# EAGLE design SatNOGSBoard (EAGLE 7.2.0)
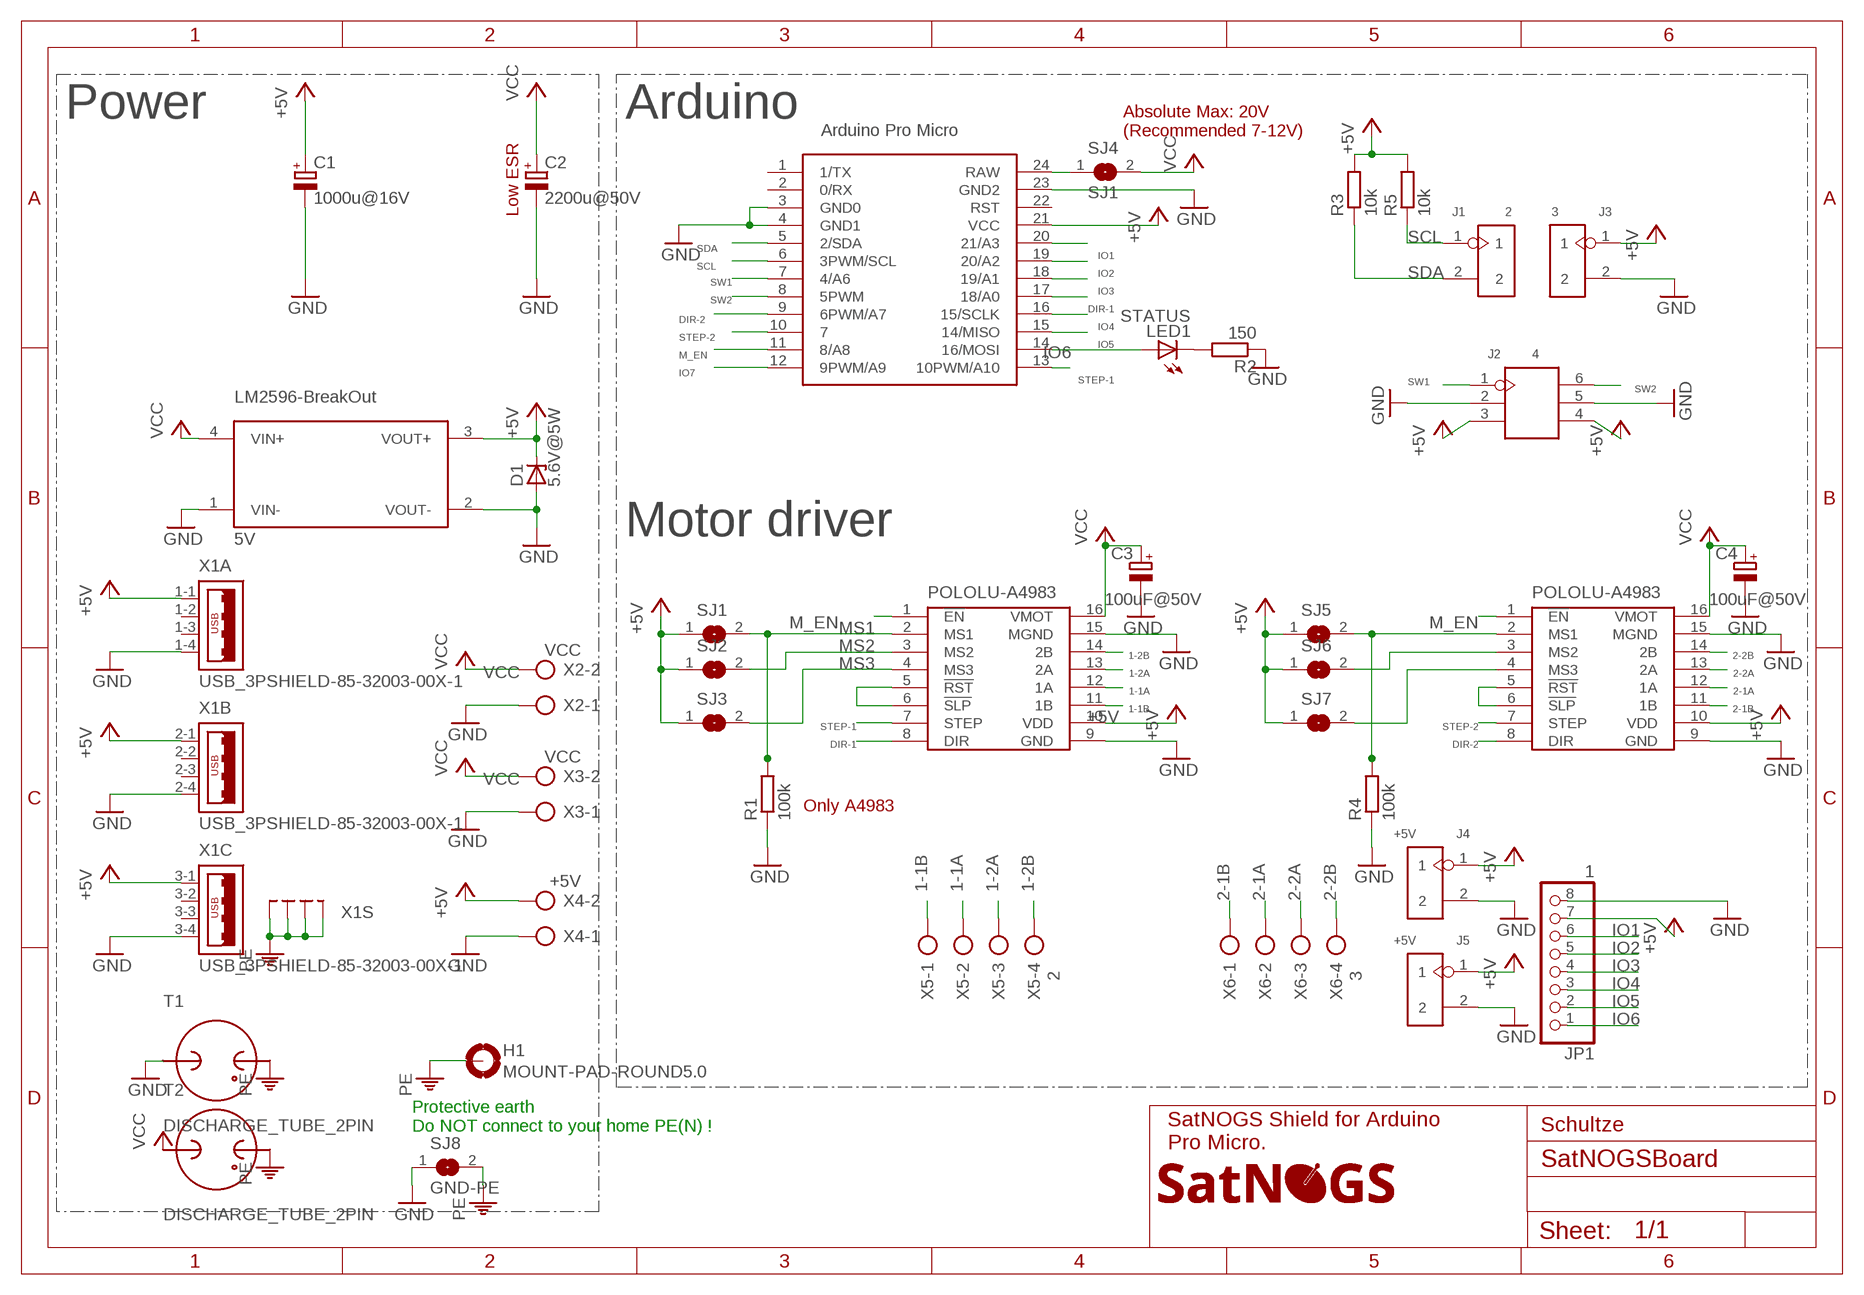
[diagram p0: schematic, sheet 1]

## Parts
B1  5V  LM2596-BREAKOUTLM2596-BREAKOUT  [LM2596-BREAKOUT]
B2  ARDUINO_PRO_MICRO"  [ARDUINO_MICRO_PRO]
B3  POLOLU-A4983/A4988"  [POLOLU-A4983]
B4  POLOLU-A4983/A4988"  [POLOLU-A4983]
C1  1000u@16V  CPOL-EUE3.5-8  [E3,5-8]
C2  2200u@50V  CPOL-EUE7.5-16  [E7,5-16]
C3  100uF@50V  CPOL-EUE2.5-6  [E2,5-6]
C4  100uF@50V  CPOL-EUE2.5-6  [E2,5-6]
D1  5.6V@5W  ZENER-DIODEDO41Z10  [DO41Z10]
H1  MOUNT-PAD-ROUND5.0  [5,0-PAD]
J1  2  HEADER-2P-65/35MIL  [2P-2.54-65/35MIL]
J2  4  HEADER-2X3P-2.54  [2X3P-2.54-65/35MIL]
J3  3  HEADER-2P-65/35MIL  [2P-2.54-65/35MIL]
J4  +5V  HEADER-2P-65/35MIL  [2P-2.54-65/35MIL]
J5  +5V  HEADER-2P-65/35MIL  [2P-2.54-65/35MIL]
JP1  1  PINHD-1X8  [1X08]
LED1  STATUS  LED3MM  [LED3MM]
LOGO1  SATNOGS_LOGOSILK_M  [LOGO_SILK_M]
R1  100k  R-EU_R0805  [R0805]
R2  150  R-EU_R0805  [R0805]
R3  10k  R-EU_R0805  [R0805]
R4  100k  R-EU_R0805  [R0805]
R5  10k  R-EU_R0805  [R0805]
SJ1  SJ1  SJ  [SJ]
SJ2  SJ1  SJ  [SJ]
SJ3  SJ1  SJ  [SJ]
SJ4  SJ1  SJ  [SJ]
SJ5  SJ1  SJ  [SJ]
SJ6  SJ1  SJ  [SJ]
SJ7  SJ1  SJ  [SJ]
SJ8  GND-PE  SJ  [SJ]
T1  DISCHARGE_TUBE_2PIN  [DISCHARGE_2WIRE]
T2  DISCHARGE_TUBE_2PIN  [DISCHARGE_2WIRE]
X1  USB_3PSHIELD-85-32003-00X-1  [85-32003-00X-1]
X2  VCC  AK500/2  [AK500/2]
X3  VCC  AK500/2  [AK500/2]
X4  +5V  AK500/2  [AK500/2]
X5  2  AK500/4  [AK500/4]
X6  3  AK500/4  [AK500/4]

## Nets
1-1A [power]: B3.12(1A) X5.2
1-1B [power]: B3.11(1B) X5.1
1-2A [power]: B3.13(2A) X5.3
1-2B [power]: B3.14(2B) X5.4
2-1A [power]: B4.12(1A) X6.2
2-1B [power]: B4.11(1B) X6.1
2-2A [power]: B4.13(2A) X6.3
2-2B [power]: B4.14(2B) X6.4
+5V: B1.3(VOUT+) B2.21(VCC) B3.10(VDD) B4.10(VDD) C1.+ D1.C J2.3 J2.4 J3.1 J4.1 J5.1 JP1.7 R3.2 R5.2 SJ1.1 SJ2.1 SJ3.1 SJ5.1 SJ6.1 SJ7.1 X1.1-1 X1.2-1 X1.3-1 X4.2
DIR-1: B2.17(18/A0) B3.8(DIR)
DIR-2: B2.9(6PWM/A7) B4.8(DIR)
GND: B1.1(VIN-) B1.2(VOUT-) B2.3(GND0) B2.4(GND1) B2.23(GND2) B3.9(GND) B3.15(MGND) B4.9(GND) B4.15(MGND) C1.- C2.- C3.- C4.- D1.A J2.2 J2.5 J3.2 J4.2 J5.2 JP1.8 R1.1 R2.1 R4.1 SJ8.1 T1.P$1 X1.1-4 X1.2-4 X1.3-4 X2.1 X3.1 X4.1
IO1: B2.20(21/A3) JP1.6
IO2: B2.19(20/A2) JP1.5
IO3: B2.18(19/A1) JP1.4
IO4: B2.16(15/SCLK) JP1.3
IO5: B2.15(14/MISO) JP1.2
IO6: B2.14(16/MOSI) JP1.1 LED1.A
IO7: B2.12(9PWM/A9)
M_EN: B2.11(8/A8) B3.1(!EN) B4.1(!EN)
MS1: B3.2(MS1) R1.2 SJ1.2
MS2: B3.3(MS2) SJ2.2
MS3: B3.4(MS3) SJ3.2
MS4: B4.2(MS1) R4.2 SJ5.2
MS5: B4.3(MS2) SJ6.2
MS6: B4.4(MS3) SJ7.2
N$1: B3.5(!RST) B3.6(!SLP)
N$2: B4.5(!RST) B4.6(!SLP)
N$3: B2.24(RAW) SJ4.1
N$6: LED1.K(C) R2.2
PE: H1.B5(MOUNT) SJ8.2 T1.P$2 T2.P$2 X1.M1(S:S1) X1.M2(S:S2) X1.M3(S:S3) X1.M4(S:S4)
SCL: B2.6(3PWM/SCL) J1.1 R5.1
SDA: B2.5(2/SDA) J1.2 R3.1
STEP-1: B2.13(10PWM/A10) B3.7(STEP)
STEP-2: B2.10 B4.7(STEP)
SW1: B2.7(4/A6) J2.1
SW2: B2.8(5PWM) J2.6
VCC [power]: B1.4(VIN+) B3.16(VMOT) B4.16(VMOT) C2.+ C3.+ C4.+ SJ4.2 T2.P$1 X2.2 X3.2
Unconnected: B2.1(1/TX) B2.2(0/RX) B2.22(RST) X1.1-2 X1.1-3 X1.2-2 X1.2-3 X1.3-2 X1.3-3

## Notes on the sheet
- Power | Arduino
- Absolute Max: 20V
  (Recommended 7-12V)
- Low ESR
- Motor driver
- Only A4983
- Protective earth
  Do NOT connect to your home PE(N) !
- Schultze
- SatNOGS Shield for Arduino
  Pro Micro.

## Library data of the parts
B1 = satnogs:LM2596-BREAKOUT: Break out for LM2596 Switching power supply (regulated) Footprint approx. 41mmx21mm
B2 = satnogs:ARDUINO_PRO_MICRO
B3 B4 = satnogs:POLOLU-A4983/A4988: Stepper motor driver https://www.pololu.com/product/1182
C1-C4 = rcl:CPOL-EU: POLARIZED CAPACITOR, European symbol
D1 = diode:ZENER-DIODE: Z-Diode; MPN: 1N5339B
H1 = holes:MOUNT-PAD-ROUND: MOUNTING PAD, round
J1 J3-J5 = Connector:HEADER-2P
J2 = Connector:HEADER-2X3P
JP1 = pinhead:PINHD-1X8: PIN HEADER
LED1 = led:LED: LED OSRAM: - CHIPLED LG R971, LG N971, LY N971, LG Q971, LY Q971, LO R971, LY R971 LH N974, LH R974 LS Q976, LO Q976, LY Q976 LO Q996 - Hyper CHIPLED LW Q18S LB Q993, LB Q99A, LB R99A - SideLED LS A670, LO A670, LY A670, LG A670, LP A670 LB A673, LV A673, LT A673, LW A673 LH A674 LY A675 LS A676, LA A676, LO A676, LY A676, LW A676 LS A679, LY A679, LG A679 - Hyper Micro SIDELED® LS Y876, LA Y876, LO Y876, LY Y876 LT Y87S - SmartLED LW L88C, LW L88S LB L89C, LB L89S, LG L890 LS L89K, LO L89K, LY L89K LS L896, LA L896, LO L896, LY L896 - TOPLED LS T670, LO T670, LY T670, LG T670, LP T670 LSG T670, LSP T670, LSY T670, LOP T670, LYG T670 LG T671, LOG T671, LSG T671 LB T673, LV T673, LT T673, LW T673 LH T674 LS T676, LA T676, LO T676, LY T676, LB T676, LH T676, LSB T676, LW T676 LB T67C, LV T67C, LT T67C, LS T67K, LO T67K, LY T67K, LW E67C LS E67B, LA E67B, LO E67B, LY E67B, LB E67C, LV E67C, LT E67C LW T67C LS T679, LY T679, LG T679 LS T770, LO T770, LY T770, LG T770, LP T770 LB T773, LV T773, LT T773, LW T773 LH T774 LS E675, LA E675, LY E675, LS T675 LS T776, LA T776, LO T776, LY T776, LB T776 LHGB T686 LT T68C, LB T68C - Hyper Mini TOPLED® LB M676 - Mini TOPLED Santana® LG M470 LS M47K, LO M47K, LY M47K Source: http://www.osram.convergy.de LUXEON: - LUMILED® LXK2-PW12-R00, LXK2-PW12-S00, LXK2-PW14-U00, LXK2-PW14-V00 LXK2-PM12-R00, LXK2-PM12-S00, LXK2-PM14-U00 LXK2-PE12-Q00, LXK2-PE12-R00, LXK2-PE12-S00, LXK2-PE14-T00, LXK2-PE14-U00 LXK2-PB12-K00, LXK2-PB12-L00, LXK2-PB12-M00, LXK2-PB14-N00, LXK2-PB14-P00, LXK2-PB14-Q00 LXK2-PR12-L00, LXK2-PR12-M00, LXK2-PR14-Q00, LXK2-PR14-R00 LXK2-PD12-Q00, LXK2-PD12-R00, LXK2-PD12-S00 LXK2-PH12-R00, LXK2-PH12-S00 LXK2-PL12-P00, LXK2-PL12-Q00, LXK2-PL12-R00 Source: www.luxeon.com KINGBRIGHT: KA-3528ASYC Source: www.kingbright.com
LOGO1 = satnogs:SATNOGS_LOGO
R1-R5 = rcl:R-EU_: RESISTOR, European symbol
SJ1-SJ8 = jumper:SJ: SMD solder JUMPER
T1 T2 = satnogs:DISCHARGE_TUBE_2PIN: 2027 Series - 2-Pole Gas Discharge Tube Surge current 25kA Author: Alexander Schultze (03/15); MF: BOURNS; MPN: 2027-09-CLF; OC_FARNELL: 2383324
X1 = con-cypressindustries:USB_3PSHIELD-: Triple USB Connector Source: www.cypressindustries.com; OC_FARNELL: unknown; OC_NEWARK: unknown
X2-X4 = con-ptr500:AK500/2: CONNECTOR; OC_FARNELL: unknown; OC_NEWARK: unknown
X5 X6 = con-ptr500:AK500/4: CONNECTOR; OC_FARNELL: unknown; OC_NEWARK: unknown

## Net classes
0 default: width 0.203 mm, drill 0.813 mm, clearance 0.254 mm
1 power: width 0.813 mm, drill 0.813 mm, clearance 0.254 mm

## Board
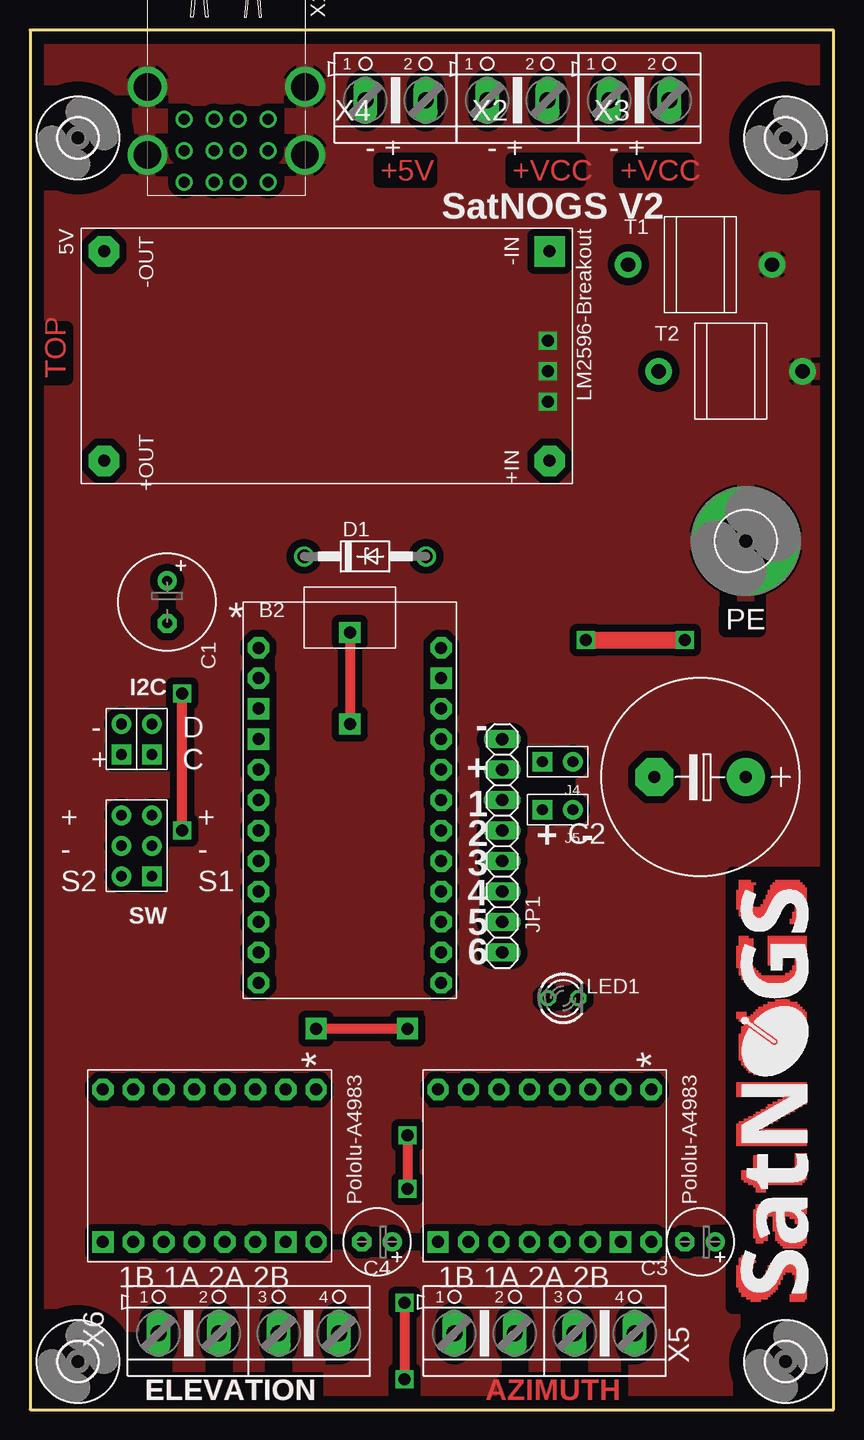
[diagram p1: board, top side]
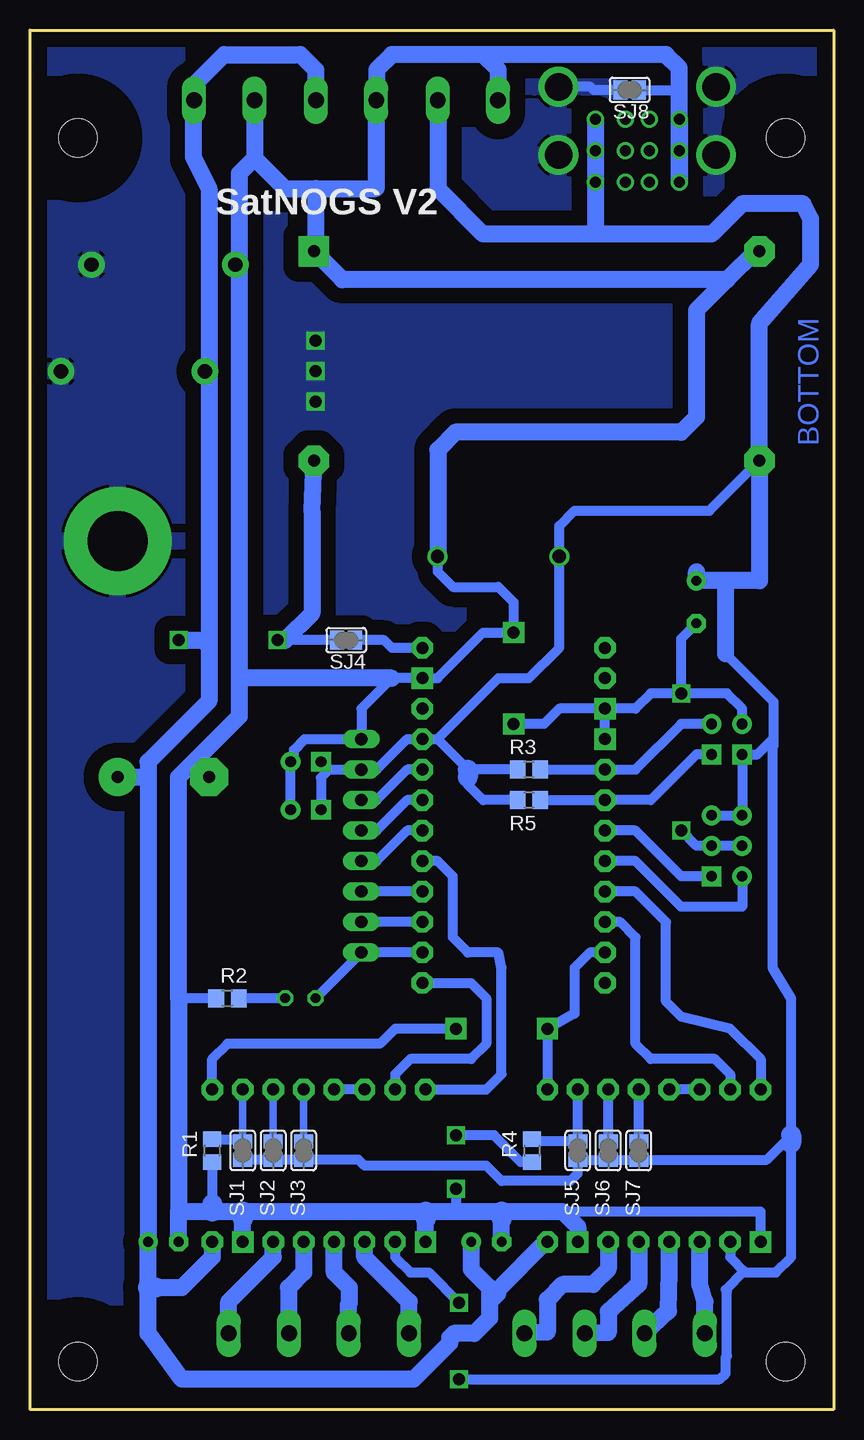
[diagram p2: board, bottom side, seen from below]

Size 67 x 115 mm. Coordinates in mm from the lower left corner, seen from the top.
Outline: 0,0 67,0 67,115 0,115 0,0
Copper layers (1*16): Top 0.035mm / dielectric 1.5mm / Bottom 0.035mm
Design rules "platinenbelichter *": minimum track width 8mil, minimum drill 24mil, track to track 10mil, track to pad 10mil, pad to pad 10mil, via to via 10mil, smd to smd 10mil, copper to edge 40mil, drill to drill 8mil, minimum pad ring 10mil, minimum via ring 8mil, stop-mask expansion 10mil, vias tented up to drill 0mil, thermal gap 10mil

### Footprints (pad centres in the part's own frame; a part is rotated, then mirrored left to right if it is on the bottom)
LM2596-BREAKOUT = drill 1 pad 2.54 square: 1 -8.89,17.78 | drill 1 pad 2.54 octagon: 2 -8.89,-19.367; 3 8.572,-19.367; 4 8.572,17.78
ARDUINO_MICRO_PRO = drill 1 pad 1.778 octagon: 1 -7.62,12.7; 2 -7.62,10.16; 5 -7.62,2.54; 6 -7.62,0; 7 -7.62,-2.54; 8 -7.62,-5.08; 9 -7.62,-7.62; 10 -7.62,-10.16; 11 -7.62,-12.7; 12 -7.62,-15.24; 13 7.62,-15.24; 14 7.62,-12.7; 15 7.62,-10.16; 16 7.62,-7.62; 17 7.62,-5.08; 18 7.62,-2.54; 19 7.62,0; 20 7.62,2.54; 21 7.62,5.08; 22 7.62,7.62; 24 7.62,12.7 | drill 1 pad 1.778 square: 3 -7.62,7.62; 4 -7.62,5.08; 23 7.62,10.16
POLOLU-A4983 = drill 1 pad 1.778 octagon: 1 -6.35,8.89; 2 -6.35,6.35; 3 -6.35,3.81; 4 -6.35,1.27; 5 -6.35,-1.27; 6 -6.35,-3.81; 7 -6.35,-6.35; 8 -6.35,-8.89; 10 6.35,-6.35; 11 6.35,-3.81; 12 6.35,-1.27; 13 6.35,1.27; 14 6.35,3.81; 16 6.35,8.89 | drill 1 pad 1.778 square: 9 6.35,-8.89; 15 6.35,6.35
E3,5-8 = drill 0.813 pad 1.6: + -1.778,0 | drill 0.813 pad 1.6 octagon: - 1.778,0
E7,5-16 = drill 1.016 pad 3.15: + -3.81,0 | drill 1.016 pad 3.15 octagon: - 3.81,0
E2,5-6 = drill 0.813 pad 1.6: + -1.27,0 | drill 0.813 pad 1.6 octagon: - 1.27,0
DO41Z10 = drill 1.118: A 5.08,0; C -5.08,0
5,0-PAD = drill 5 pad 9: B5 0,0
2P-2.54-65/35MIL = drill 0.889 pad 1.651 square: 1 0,1.27 | drill 0.889 pad 1.651: 2 0,-1.27
2X3P-2.54-65/35MIL = drill 0.889 pad 1.651 square: 1 -1.27,2.54 | drill 0.889 pad 1.651: 2 -1.27,0; 3 -1.27,-2.54; 4 1.27,-2.54; 5 1.27,0; 6 1.27,2.54
1X08 = drill 1.016 long: 1 -8.89,0; 2 -6.35,0; 3 -3.81,0; 4 -1.27,0; 5 1.27,0; 6 3.81,0; 7 6.35,0; 8 8.89,0
LED3MM = drill 0.813 octagon: A -1.27,0; K 1.27,0
R0805 = smd 1.3 x 1.5: 1 -0.95,0; 2 0.95,0
SJ = smd 1.168 x 1.6: 1 -0.762,0; 2 0.762,0
DISCHARGE_2WIRE = drill 1.2 pad 2.2: P$1 -6,0; P$2 6,0
3,2 = hole 3.2: 0,0
85-32003-00X-1 = drill 0.92 pad 1.27: 1-1 2.71,3.5; 1-2 2.71,1; 1-3 2.71,-1; 1-4 2.71,-3.5; 2-1 5.33,3.5; 2-2 5.33,1; 2-3 5.33,-1; 2-4 5.33,-3.5; 3-1 7.95,3.5; 3-2 7.95,1; 3-3 7.95,-1; 3-4 7.95,-3.5 | drill 2.3 pad 3: M1 0,6.57; M2 0,-6.57; M3 5.68,6.57; M4 5.68,-6.57
AK500/2 = drill 1.321 long: 1 -2.515,0; 2 2.515,0
AK500/4 = drill 1.321 long: 1 -7.518,0; 2 -2.489,0; 3 2.489,0; 4 7.518,0

### Placement (x,y rotation side)
B1  25.55,87.67 270 top
B2  26.67,50.8 0 top
B3  42.91,20.32 270 top
B4  14.97,20.32 270 top
C1  11.43,67.31 270 top
C2  55.88,52.72 180 top
C3  55.88,13.97 180 top
C4  28.94,13.97 180 top
D1  27.94,71.12 0 top
H1  59.69,72.39 0 top
J1  10.16,55.88 180 top
J2  8.89,46.99 180 top
J3  7.62,55.88 180 top
J4  44,54 90 top
J5  44,50 90 top
JP1  39.37,46.99 90 top
LED1  44.45,34.29 0 top
LOGO1  64.89,9.71 90 top
R1  51.8,21.59 90 bottom
R2  50.53,34.29 0 bottom
R3  25.4,53.34 180 bottom
R4  25.13,21.59 90 bottom
R5  25.4,50.8 180 bottom
SJ1  49.26,21.59 90 bottom
SJ2  46.72,21.59 90 bottom
SJ3  44.18,21.59 90 bottom
SJ4  40.64,64.14 180 bottom
SJ5  21.32,21.59 90 bottom
SJ6  18.78,21.59 90 bottom
SJ7  16.24,21.59 90 bottom
SJ8  17,110 180 bottom
T1  55.88,95.44 0 top
T2  58.42,86.55 0 top
U$1  [3,2]  63,106 0 top
U$2  SATNOGS_LOGOCOPPER_M  [LOGO_COPPER_M]  64.69,9.08 90 top
U$3  [3,2]  4,106 0 top
U$5  [3,2]  63,4 0 top
U$6  [3,2]  4,4 0 top
X1  16.36,110.26 270 top
X2  40.64,109.14 0 top
X3  50.8,109.14 0 top
X4  30.48,109.14 0 top
X5  42.91,6.35 0 top
X6  18.24,6.35 0 top

### Tracks (layer width: path | path; a pad name or v marks a point on that pad's centre or on a via)
1-1A
  Bottom 1.422: X5.2 40.42,8.84 40.37,8.89 40.37,10.16 41.64,11.43 B3.12
1-1B
  Bottom 1.422: X5.1 35.39,8.99 39.1,12.7 B3.11
1-2A
  Bottom 1.422: B3.13 44.18,11.43 45.45,10.16 45.45,6.4 X5.3
1-2B
  Bottom 1.422: X5.4 50.43,8.99 46.72,12.7 B3.14
2-1A
  Bottom 1.422: X6.2 13.75,8.21 13.7,11.43 B4.12
2-1B
  Bottom 1.422: X6.1 10.72,8.99 11.16,10.43 B4.11
2-2A
  Bottom 1.422: B4.13 16.24,10.43 18.78,8.16 18.78,6.4 X6.3
2-2B
  Bottom 1.422: X6.4 23.86,6.45 23.86,9.16 22.59,10.43 20.05,10.43 18.78,11.7 B4.14
+5V  (via drill 1)
  Top 0.813: v31.21,8.89 v31.21,2.54
  Bottom 0.813: SJ1.1 SJ2.1 SJ3.1 39.61,20.83 39.1,20.32 28.94,20.32 27.67,19.05 21.95,19.05 21.32,19.68 SJ5.1 SJ6.1 SJ7.1 5.57,20.83 3.54,22.86 3.54,34.29 5.08,36.83 5.08,55.24 5,55.33 5,55.96 | J2.3 J2.4 J3.1 6.35,54.61 5,55.96 | B4.10 8.62,12.7 7.46,11.54 | 7.46,11.54 7.35,11.43 4.81,11.43 3.54,12.7 3.54,22.23 | B3.10 36.56,12.7 35.29,11.43 33.75,11.43 v31.21,8.89 | v31.21,2.54 9.46,2.54 9,3 9,4.33 8.89,4.45 8.89,9.89 9,10 7.46,11.54 | R3.2 30.48,53.34 33.02,55.88 | 30.48,52.7 30.48,52.07 29.21,50.8 R5.2 26.67,51.12 | 33.02,55.88 B2.21 35.56,55.88 38.1,53.34 JP1.7 42.07,53.34 | 33.02,55.88 27.94,60.96 25.4,60.96 22.86,63.5 D1.C 22.86,73.66 21.59,74.93 10.35,74.93 B1.3 | J4.1 42.07,53.34 | 42.07,53.34 42.73,52.68 J5.1 | 5,55.96 5,59 9,63
  Bottom 1.422: X1.1-1 X1.2-1 X1.3-1 19.86,98.44 20.32,97.98 | X4.2 32.99,101.77 29.21,97.98 20.32,97.98 | 11.43,69.85 C1.+ 9,69.09 | 20.32,97.98 10.16,97.98 7.62,100.52 2.54,100.52 1.91,99.25 1.91,95.44 6.18,90.53 B1.3 6.18,69.09 9,69.09 | 9,63 9,69.09
  Bottom 1.676: 30.48,53.34 30.48,52.7 | 3.54,22.86 3.54,22.23
DIR-1
  Bottom 0.813: B3.8 28.94,26.67 27.67,27.94 27.67,36.83 27.94,38.1 30.48,38.1 31.75,39.37 31.75,44.45 33.02,45.72 B2.17
DIR-2
  Bottom 0.813: B4.8 6.08,29.21 8.62,31.75 12.7,32.75 13.97,34.02 13.97,40.64 16.51,43.18 B2.9
GND  (via drill 1, 1 pad 1.78)
  Top 0.813: v26.67,64.77 v26.67,57.15 | v31.48,22.86 v31.48,18.41 | v12.7,48.26 v12.7,59.69
  Bottom 0.813: B2.4 B2.3 | B4.9 6.08,16.51 27.67,16.51 | v26.67,57.15 24.13,57.15 22.86,58.42 B2.3 | v12.7,59.69 8.89,59.69 7.62,58.42 J3.2 | v12.7,59.69 15.24,59.69 16.51,58.42 B2.3 | J2.2 J2.5 11.43,46.99 v12.7,48.26 | R1.1 51.8,17.14 | v31.48,18.41 31.48,16.51 | R4.1 26.09,20.64 28.3,22.86 v31.48,22.86 | R2.1 54.61,34.29 | v12.7,59.69 12.7,64.26 C1.- | D1.A 33.02,69.85 31.75,68.58 27.94,68.58 26.67,67.31 v26.67,64.77 29.21,64.77 33.02,60.96 B2.23 36.83,60.96 39.37,58.42 JP1.8 44.12,55.88 45,55 45,54.27 J4.2 J5.2 | SJ8.1 12.86,110
  Bottom 1.422: 54.61,16.51 54.61,34.29 54.61,52.72 53.34,53.99 | 54.61,16.51 51.8,16.51 49.26,16.51 34.02,16.51 31.48,16.51 27.67,16.51 22.59,16.51 21.32,15.24 B4.15 | C3.- 54.61,16.51 | C4.- 27.67,15.88 | B3.9 34.02,15.88 | B3.15 49.26,15.88 | X3.1 48.28,104.36 48.26,104.33 | 48.26,104.33 45.72,101.79 43.18,101.79 | 43.18,101.79 38.15,101.79 38.12,101.81 X2.1 38.1,109.17 38.1,111.68 36.83,112.95 29.21,112.95 | 53.34,53.99 49.53,57.8 49.53,60.96 | 49.53,60.96 49.53,95.44 | 49.53,95.44 49.53,103.06 48.26,104.33 | X4.1 27.94,109.14 27.94,111.68 29.21,112.95 | T1.P$1 49.53,95.44 | 36.83,60.96 49.53,60.96 | C2.- 53.34,53.99 | X1.1-4 X1.2-4 X1.3-4 12.86,110 12.86,111.84 13.97,112.95 29.21,112.95 | B1.2 6.5,96.56 8.89,94.17 | 8.89,94.17 40.94,94.17 B1.1 | 8.89,94.17 11.43,91.63 11.43,82.74 12.7,81.47 31.53,81.47 33,80 33,71.14 D1.A | 43.18,101.79 43.18,96.71
  Bottom 1.676: 49.26,16.51 49.26,15.88 | 34.02,16.51 34.02,15.88 | 27.67,16.51 27.67,15.88 | 51.8,16.51 51.8,17.14
IO1
  Bottom 0.813: B2.20 35.56,53.34 38.1,50.8 JP1.6
IO2
  Bottom 0.813: B2.19 35.56,50.8 38.1,48.26 JP1.5
IO3
  Bottom 0.813: B2.18 35.56,48.26 38.1,45.72 JP1.4
IO4
  Bottom 0.813: B2.16 JP1.3
IO5
  Bottom 0.813: B2.15 JP1.2
IO6
  Bottom 0.813: B2.14 JP1.1 LED1.A
M_EN  (via drill 1 pad 1.78)
  Top 0.813: v31.48,31.75 v23.86,31.75
  Bottom 0.813: B4.1 v23.86,31.75 21.59,33.02 21.59,36.83 20.32,38.1 B2.11 | B3.1 51.8,29.21 50.53,30.48 37.83,30.48 36.56,31.75 v31.48,31.75
MS1
  Bottom 0.61: B3.2 SJ1.2 49.45,22.54
  Bottom 0.813: R1.2 49.45,22.54
MS2
  Bottom 0.61: SJ2.2 B3.3
MS3
  Bottom 0.61: SJ3.2 B3.4
MS4
  Bottom 0.813: B4.2 SJ5.2 24.94,22.35 R4.2
MS5
  Bottom 0.813: SJ6.2 B4.3
MS6
  Bottom 0.813: SJ7.2 B4.4
N$1
  Bottom 0.813: B3.6 B3.5
N$2
  Bottom 0.813: B4.6 B4.5
N$3
  Bottom 0.813: B2.24 36.83,63.5 37.47,64.14 SJ4.1
N$6
  Bottom 0.813: LED1.K R2.2
PE  (via drill 1)
  Bottom 0.813: SJ8.2 20,110 20.26,110.26 X1.M1
  other vias: 43.18,84.01 43.18,86.55 43.18,89.09
  pour Bottom (isolate 1.27, rank 2): 0,114.22 0,0 67.31,0 67.31,114.22
  pour Top (isolate 0.61, rank 2): 0,114.22 0,0 67.31,0 67.31,114.22
SCL
  Bottom 0.813: J1.1 11.43,54.61 15.24,50.8 B2.6 R5.1
SDA
  Bottom 0.813: J1.2 12.7,57.15 16.51,53.34 B2.5 R3.1
STEP-1
  Bottom 0.813: B3.7 36.56,27.94 35.29,29.21 30.21,29.21 28.94,30.48 28.94,34.29 30.21,35.56 B2.13
STEP-2
  Bottom 0.813: B2.10 17.78,40.64 16.51,39.37 16.51,30.48 15.24,29.21 9.89,29.21 8.62,27.94 B4.7
SW1
  Bottom 0.813: J2.1 12.7,44.45 16.51,48.26 B2.7
SW2
  Bottom 0.813: J2.6 7.62,41.91 12.7,41.91 16.51,45.72 B2.8
VCC  (via drill 1)
  Top 1.422: v46.35,64.14 v54.61,64.14
  Bottom 0.813: SJ4.2 45.72,64.14 v46.35,64.14 | 52.7,64.14 52.07,63.5
  Bottom 1.422: C4.+ 30.21,11.7 28.67,10.16 28.67,9 | 28.67,9 28.67,7.62 29.94,6.35 31.65,6.35 32,6 32,5.56 35.02,2.54 54.34,2.54 57.15,6.35 57.15,10.16 C3.+ 57.15,52.72 | B1.4 43.5,74.93 43.5,66.36 45.72,64.14 | B3.16 51.8,12.7 54.34,10.16 56.52,10.16 | X2.2 43.18,109.17 43.18,111.68 44.45,112.95 50.8,112.95 53.31,110.44 X3.2 53.34,109.11 53.34,104.33 52.07,101.79 52.07,86.55 | 52.07,86.55 52.07,63.5 52.07,59.07 57.15,53.99 57.15,52.72 | v54.61,64.14 52.7,64.14 | T2.P$1 52.07,86.55 | C2.+ 57.15,52.72 | B4.16 24.03,13.97 28,10 28,9.67 28.67,9
  Bottom 1.676: 57.15,10.16 56.52,10.16

### Text on the board
Top: +5V | +VCC | +VCC | TOP | PE | ELEVATION | AZIMUTH
Bottom: BOTTOM
tPlace: - + | - + | - + | SatNOGS V2 | PE | I2C | - | + | - / + | D / C | 1 / 2 / 3 / 4 / 5 / 6 | + | - | + / - / S2 | + / - / S1 | SW | 1B 1A 2A 2B | 1B 1A 2A 2B | ELEVATION
bPlace: SatNOGS V2
Reference: Eagle Freeware: 100x80mm | Euro: 160x100mm